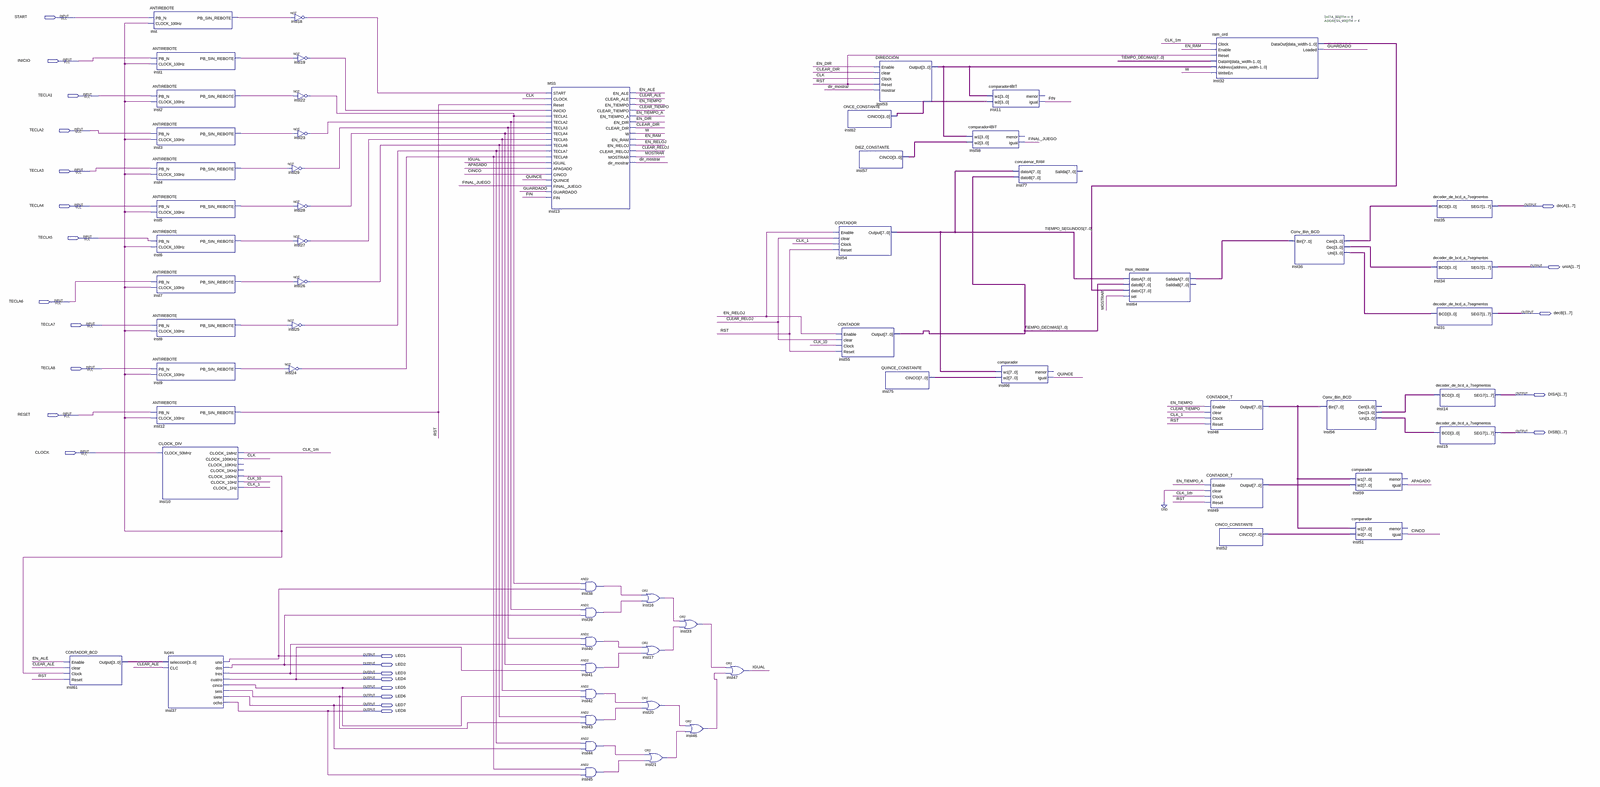
[diagram p0: schematic sheet, whole]
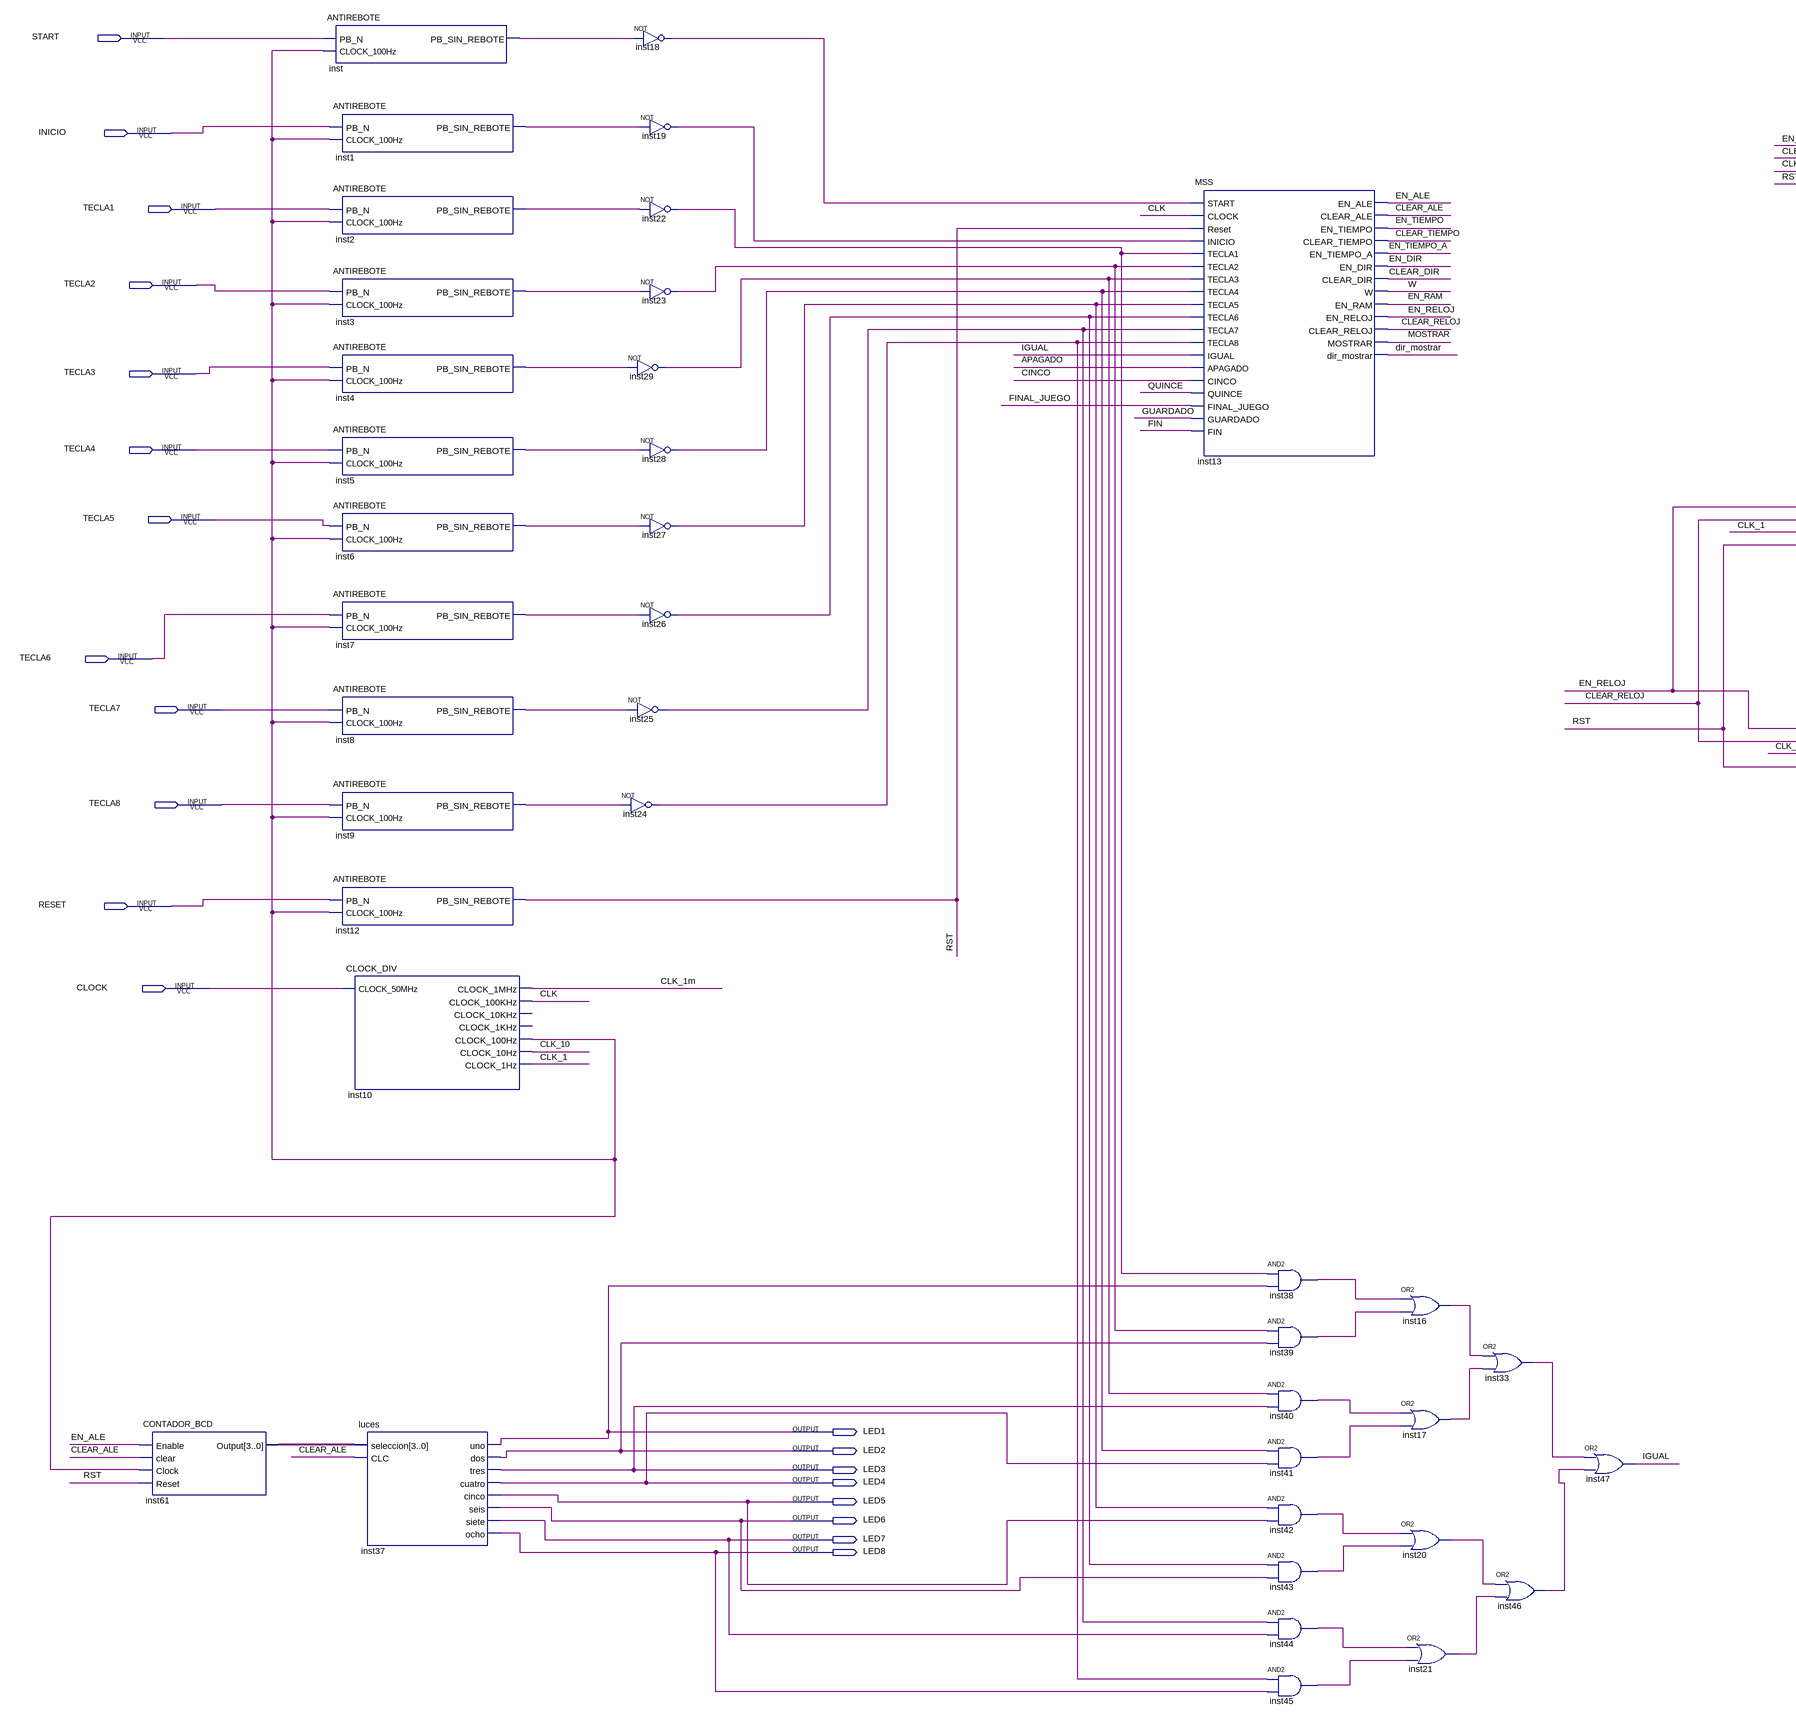
[diagram p1: schematic sheet, left part]
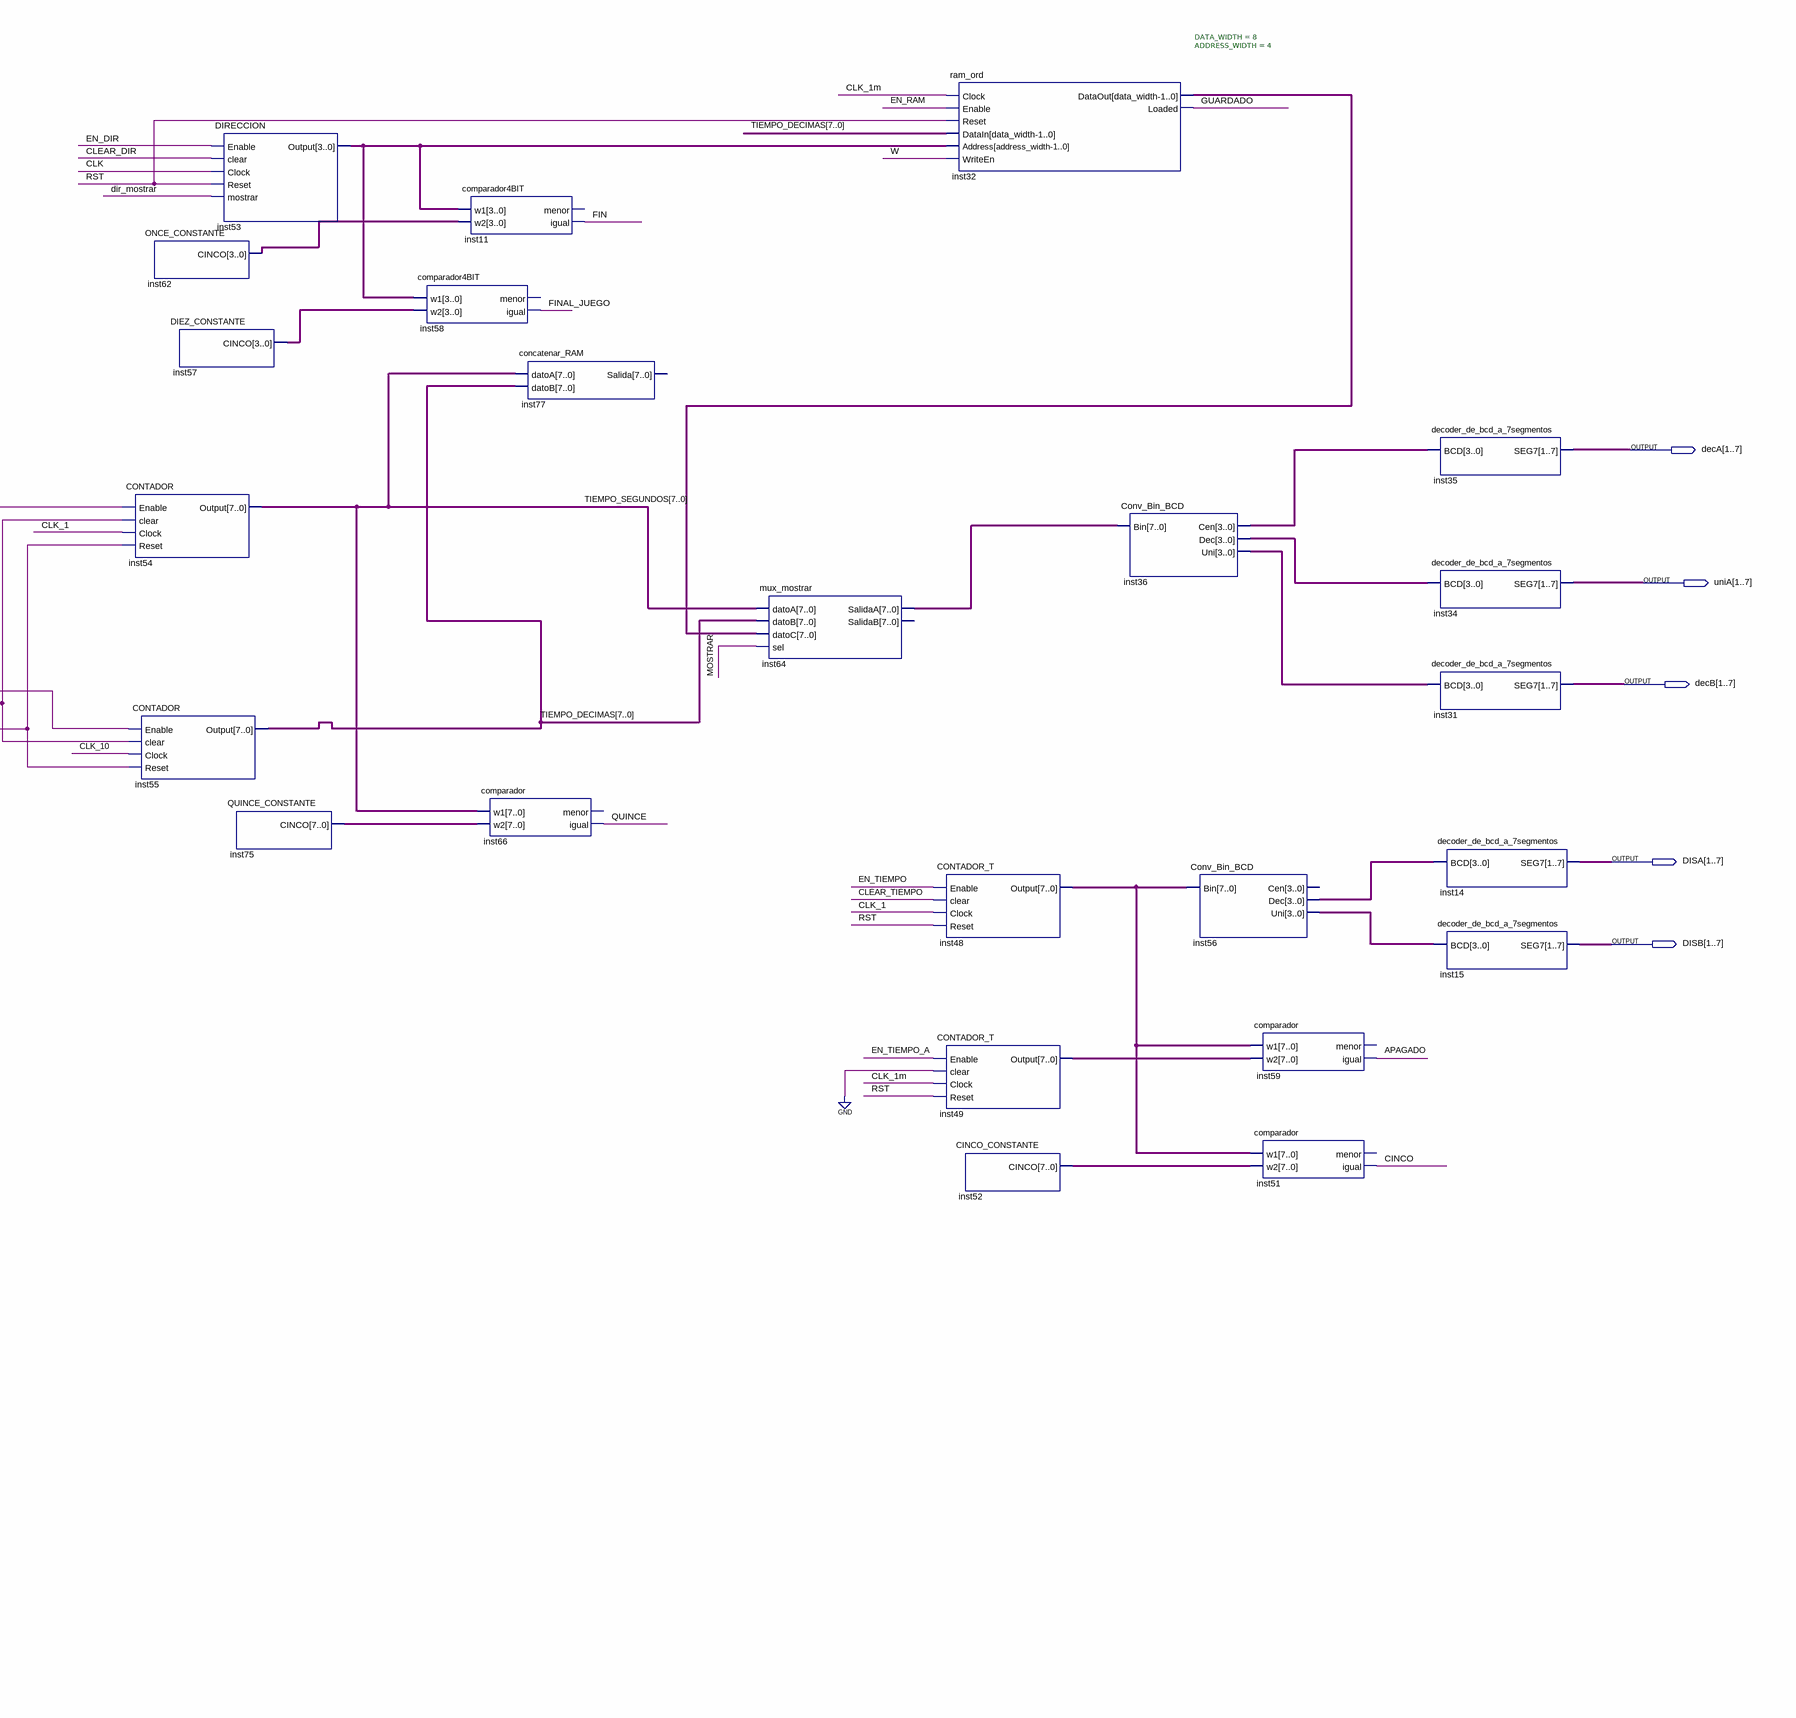
[diagram p2: schematic sheet, right part]
// Quartus schematic juego_velocidad.bdf as structural Verilog: 64 symbols, 25 pins
module juego_velocidad (
  input  START,
  input  INICIO,
  input  TECLA1,
  input  TECLA2,
  input  TECLA3,
  input  TECLA4,
  input  TECLA5,
  input  TECLA6,
  input  TECLA7,
  input  TECLA8,
  input  RESET,
  input  CLOCK,
  output [1:7] decA,
  output [1:7] uniA,
  output [1:7] decB,
  output [1:7] DISA,
  output [1:7] DISB,
  output LED1,
  output LED2,
  output LED3,
  output LED4,
  output LED5,
  output LED6,
  output LED7,
  output LED8
);

  wire APAGADO, CINCO, CLEAR_ALE, CLEAR_DIR, CLEAR_RELOJ, CLEAR_TIEMPO, CLK, CLK_1, CLK_1m, CLK_10,
       dir_mostrar, EN_ALE, EN_DIR, EN_RAM, EN_RELOJ, EN_TIEMPO, EN_TIEMPO_A, FIN, FINAL_JUEGO, GUARDADO,
       IGUAL, inst1_pb_sin_rebote, inst2_pb_sin_rebote, inst3_pb_sin_rebote, inst4_pb_sin_rebote,
       inst5_pb_sin_rebote, inst6_pb_sin_rebote, inst7_pb_sin_rebote, inst8_pb_sin_rebote,
       inst9_pb_sin_rebote, inst10_clock_100hz, inst16_out, inst17_out, inst18_out, inst19_out, inst20_out,
       inst21_out, inst22_out, inst23_out, inst24_out, inst25_out, inst26_out, inst27_out, inst28_out,
       inst29_out, inst33_out, inst38_out, inst39_out, inst40_out, inst41_out, inst42_out, inst43_out,
       inst44_out, inst45_out, inst46_out, inst_pb_sin_rebote, MOSTRAR, QUINCE, RST, W;
  wire [3:0] inst36_cen, inst36_dec, inst36_uni, inst53_output, inst56_dec, inst56_uni, inst57_cinco,
       inst61_output, inst62_cinco;
  wire [7:0] inst32_dataout, inst48_output, inst49_output, inst52_cinco, inst64_salidaa, inst75_cinco,
       TIEMPO_DECIMAS, TIEMPO_SEGUNDOS;

  CONTADOR_BCD inst61 (
    .Enable(EN_ALE), .clear(CLEAR_ALE), .Clock(inst10_clock_100hz), .Reset(RST), .Output(inst61_output));
  ANTIREBOTE inst (.PB_N(START), .CLOCK_100Hz(inst10_clock_100hz), .PB_SIN_REBOTE(inst_pb_sin_rebote));
  ANTIREBOTE inst1 (.PB_N(INICIO), .CLOCK_100Hz(inst10_clock_100hz), .PB_SIN_REBOTE(inst1_pb_sin_rebote));
  ANTIREBOTE inst2 (.PB_N(TECLA1), .CLOCK_100Hz(inst10_clock_100hz), .PB_SIN_REBOTE(inst2_pb_sin_rebote));
  ANTIREBOTE inst3 (.PB_N(TECLA2), .CLOCK_100Hz(inst10_clock_100hz), .PB_SIN_REBOTE(inst3_pb_sin_rebote));
  ANTIREBOTE inst4 (.PB_N(TECLA3), .CLOCK_100Hz(inst10_clock_100hz), .PB_SIN_REBOTE(inst4_pb_sin_rebote));
  ANTIREBOTE inst5 (.PB_N(TECLA4), .CLOCK_100Hz(inst10_clock_100hz), .PB_SIN_REBOTE(inst5_pb_sin_rebote));
  ANTIREBOTE inst6 (.PB_N(TECLA5), .CLOCK_100Hz(inst10_clock_100hz), .PB_SIN_REBOTE(inst6_pb_sin_rebote));
  ANTIREBOTE inst7 (.PB_N(TECLA6), .CLOCK_100Hz(inst10_clock_100hz), .PB_SIN_REBOTE(inst7_pb_sin_rebote));
  ANTIREBOTE inst8 (.PB_N(TECLA7), .CLOCK_100Hz(inst10_clock_100hz), .PB_SIN_REBOTE(inst8_pb_sin_rebote));
  ANTIREBOTE inst9 (.PB_N(TECLA8), .CLOCK_100Hz(inst10_clock_100hz), .PB_SIN_REBOTE(inst9_pb_sin_rebote));
  ANTIREBOTE inst12 (.PB_N(RESET), .CLOCK_100Hz(inst10_clock_100hz), .PB_SIN_REBOTE(RST));
  CLOCK_DIV inst10 (
    .CLOCK_50MHz(CLOCK), .CLOCK_1MHz(CLK_1m), .CLOCK_100KHz(CLK), .CLOCK_100Hz(inst10_clock_100hz),
    .CLOCK_10Hz(CLK_10), .CLOCK_1Hz(CLK_1));  // open: CLOCK_10KHz, CLOCK_1KHz
  luces inst37 (
    .seleccion(inst61_output), .CLC(CLEAR_ALE), .uno(LED1), .dos(LED2), .tres(LED3), .cuatro(LED4),
    .cinco(LED5), .seis(LED6), .siete(LED7), .ocho(LED8));
  not inst18 (inst18_out, inst_pb_sin_rebote);
  not inst19 (inst19_out, inst1_pb_sin_rebote);
  not inst22 (inst22_out, inst2_pb_sin_rebote);
  not inst23 (inst23_out, inst3_pb_sin_rebote);
  not inst29 (inst29_out, inst4_pb_sin_rebote);
  not inst28 (inst28_out, inst5_pb_sin_rebote);
  not inst27 (inst27_out, inst6_pb_sin_rebote);
  not inst26 (inst26_out, inst7_pb_sin_rebote);
  not inst25 (inst25_out, inst8_pb_sin_rebote);
  not inst24 (inst24_out, inst9_pb_sin_rebote);
  MSS inst13 (
    .START(inst18_out), .CLOCK(CLK), .Reset(RST), .INICIO(inst19_out), .TECLA1(inst22_out),
    .TECLA2(inst23_out), .TECLA3(inst29_out), .TECLA4(inst28_out), .TECLA5(inst27_out), .TECLA6(inst26_out),
    .TECLA7(inst25_out), .TECLA8(inst24_out), .IGUAL(IGUAL), .APAGADO(APAGADO), .CINCO(CINCO),
    .QUINCE(QUINCE), .FINAL_JUEGO(FINAL_JUEGO), .GUARDADO(GUARDADO), .FIN(FIN), .EN_ALE(EN_ALE),
    .CLEAR_ALE(CLEAR_ALE), .EN_TIEMPO(EN_TIEMPO), .CLEAR_TIEMPO(CLEAR_TIEMPO), .EN_TIEMPO_A(EN_TIEMPO_A),
    .EN_DIR(EN_DIR), .CLEAR_DIR(CLEAR_DIR), .W(W), .EN_RAM(EN_RAM), .EN_RELOJ(EN_RELOJ),
    .CLEAR_RELOJ(CLEAR_RELOJ), .MOSTRAR(MOSTRAR), .dir_mostrar(dir_mostrar));
  and inst38 (inst38_out, inst22_out, LED1);
  and inst39 (inst39_out, inst23_out, LED2);
  and inst40 (inst40_out, inst29_out, LED3);
  and inst41 (inst41_out, inst28_out, LED4);
  and inst42 (inst42_out, inst27_out, LED5);
  and inst43 (inst43_out, inst26_out, LED6);
  and inst44 (inst44_out, inst25_out, LED7);
  and inst45 (inst45_out, inst24_out, LED8);
  or inst16 (inst16_out, inst38_out, inst39_out);
  or inst17 (inst17_out, inst40_out, inst41_out);
  or inst20 (inst20_out, inst42_out, inst43_out);
  or inst21 (inst21_out, inst44_out, inst45_out);
  or inst33 (inst33_out, inst16_out, inst17_out);
  or inst46 (inst46_out, inst20_out, inst21_out);
  or inst47 (IGUAL, inst33_out, inst46_out);
  CONTADOR inst54 (.Enable(EN_RELOJ), .clear(CLEAR_RELOJ), .Clock(CLK_1), .Reset(RST), .Output(TIEMPO_SEGUNDOS));
  CONTADOR inst55 (.Enable(EN_RELOJ), .clear(CLEAR_RELOJ), .Clock(CLK_10), .Reset(RST), .Output(TIEMPO_DECIMAS));
  ONCE_CONSTANTE inst62 (.CINCO(inst62_cinco));
  DIEZ_CONSTANTE inst57 (.CINCO(inst57_cinco));
  DIRECCION inst53 (
    .Enable(EN_DIR), .clear(CLEAR_DIR), .Clock(CLK), .Reset(RST), .mostrar(dir_mostrar),
    .Output(inst53_output));
  QUINCE_CONSTANTE inst75 (.CINCO(inst75_cinco));
  comparador4BIT inst58 (.w1(inst53_output), .w2(inst57_cinco), .igual(FINAL_JUEGO));  // open: menor
  comparador4BIT inst11 (.w1(inst53_output), .w2(inst62_cinco), .igual(FIN));  // open: menor
  comparador inst66 (.w1(TIEMPO_SEGUNDOS), .w2(inst75_cinco), .igual(QUINCE));  // open: menor
  concatenar_RAM inst77 (.datoA(TIEMPO_SEGUNDOS), .datoB(TIEMPO_DECIMAS));  // open: Salida
  mux_mostrar inst64 (
    .datoA(TIEMPO_SEGUNDOS), .datoB(TIEMPO_DECIMAS), .datoC(inst32_dataout), .sel(MOSTRAR),
    .SalidaA(inst64_salidaa));  // open: SalidaB
  ram_ord #(.DATA_WIDTH(8), .ADDRESS_WIDTH(4)) inst32 (
    .Clock(CLK_1m), .Enable(EN_RAM), .Reset(RST), .DataIn(TIEMPO_DECIMAS), .Address(inst53_output),
    .WriteEn(W), .DataOut(inst32_dataout), .Loaded(GUARDADO));
  CONTADOR_T inst48 (.Enable(EN_TIEMPO), .clear(CLEAR_TIEMPO), .Clock(CLK_1), .Reset(RST), .Output(inst48_output));
  CONTADOR_T inst49 (.Enable(EN_TIEMPO_A), .clear(1'b0), .Clock(CLK_1m), .Reset(RST), .Output(inst49_output));
  CINCO_CONSTANTE inst52 (.CINCO(inst52_cinco));
  Conv_Bin_BCD inst36 (.Bin(inst64_salidaa), .Cen(inst36_cen), .Dec(inst36_dec), .Uni(inst36_uni));
  Conv_Bin_BCD inst56 (.Bin(inst48_output), .Dec(inst56_dec), .Uni(inst56_uni));  // open: Cen
  comparador inst59 (.w1(inst48_output), .w2(inst49_output), .igual(APAGADO));  // open: menor
  comparador inst51 (.w1(inst48_output), .w2(inst52_cinco), .igual(CINCO));  // open: menor
  decoder_de_bcd_a_7segmentos inst35 (.BCD(inst36_cen), .SEG7(decA));
  decoder_de_bcd_a_7segmentos inst34 (.BCD(inst36_dec), .SEG7(uniA));
  decoder_de_bcd_a_7segmentos inst31 (.BCD(inst36_uni), .SEG7(decB));
  decoder_de_bcd_a_7segmentos inst14 (.BCD(inst56_dec), .SEG7(DISA));
  decoder_de_bcd_a_7segmentos inst15 (.BCD(inst56_uni), .SEG7(DISB));
endmodule
